# EasyEDA schematic 1-Schematic_Delta.json
TITLE: Sheet_1; REV: 1.0; Date: 2026-04-15; Sheet: 1/1; Drawn By: DosLike; Company: Your Company
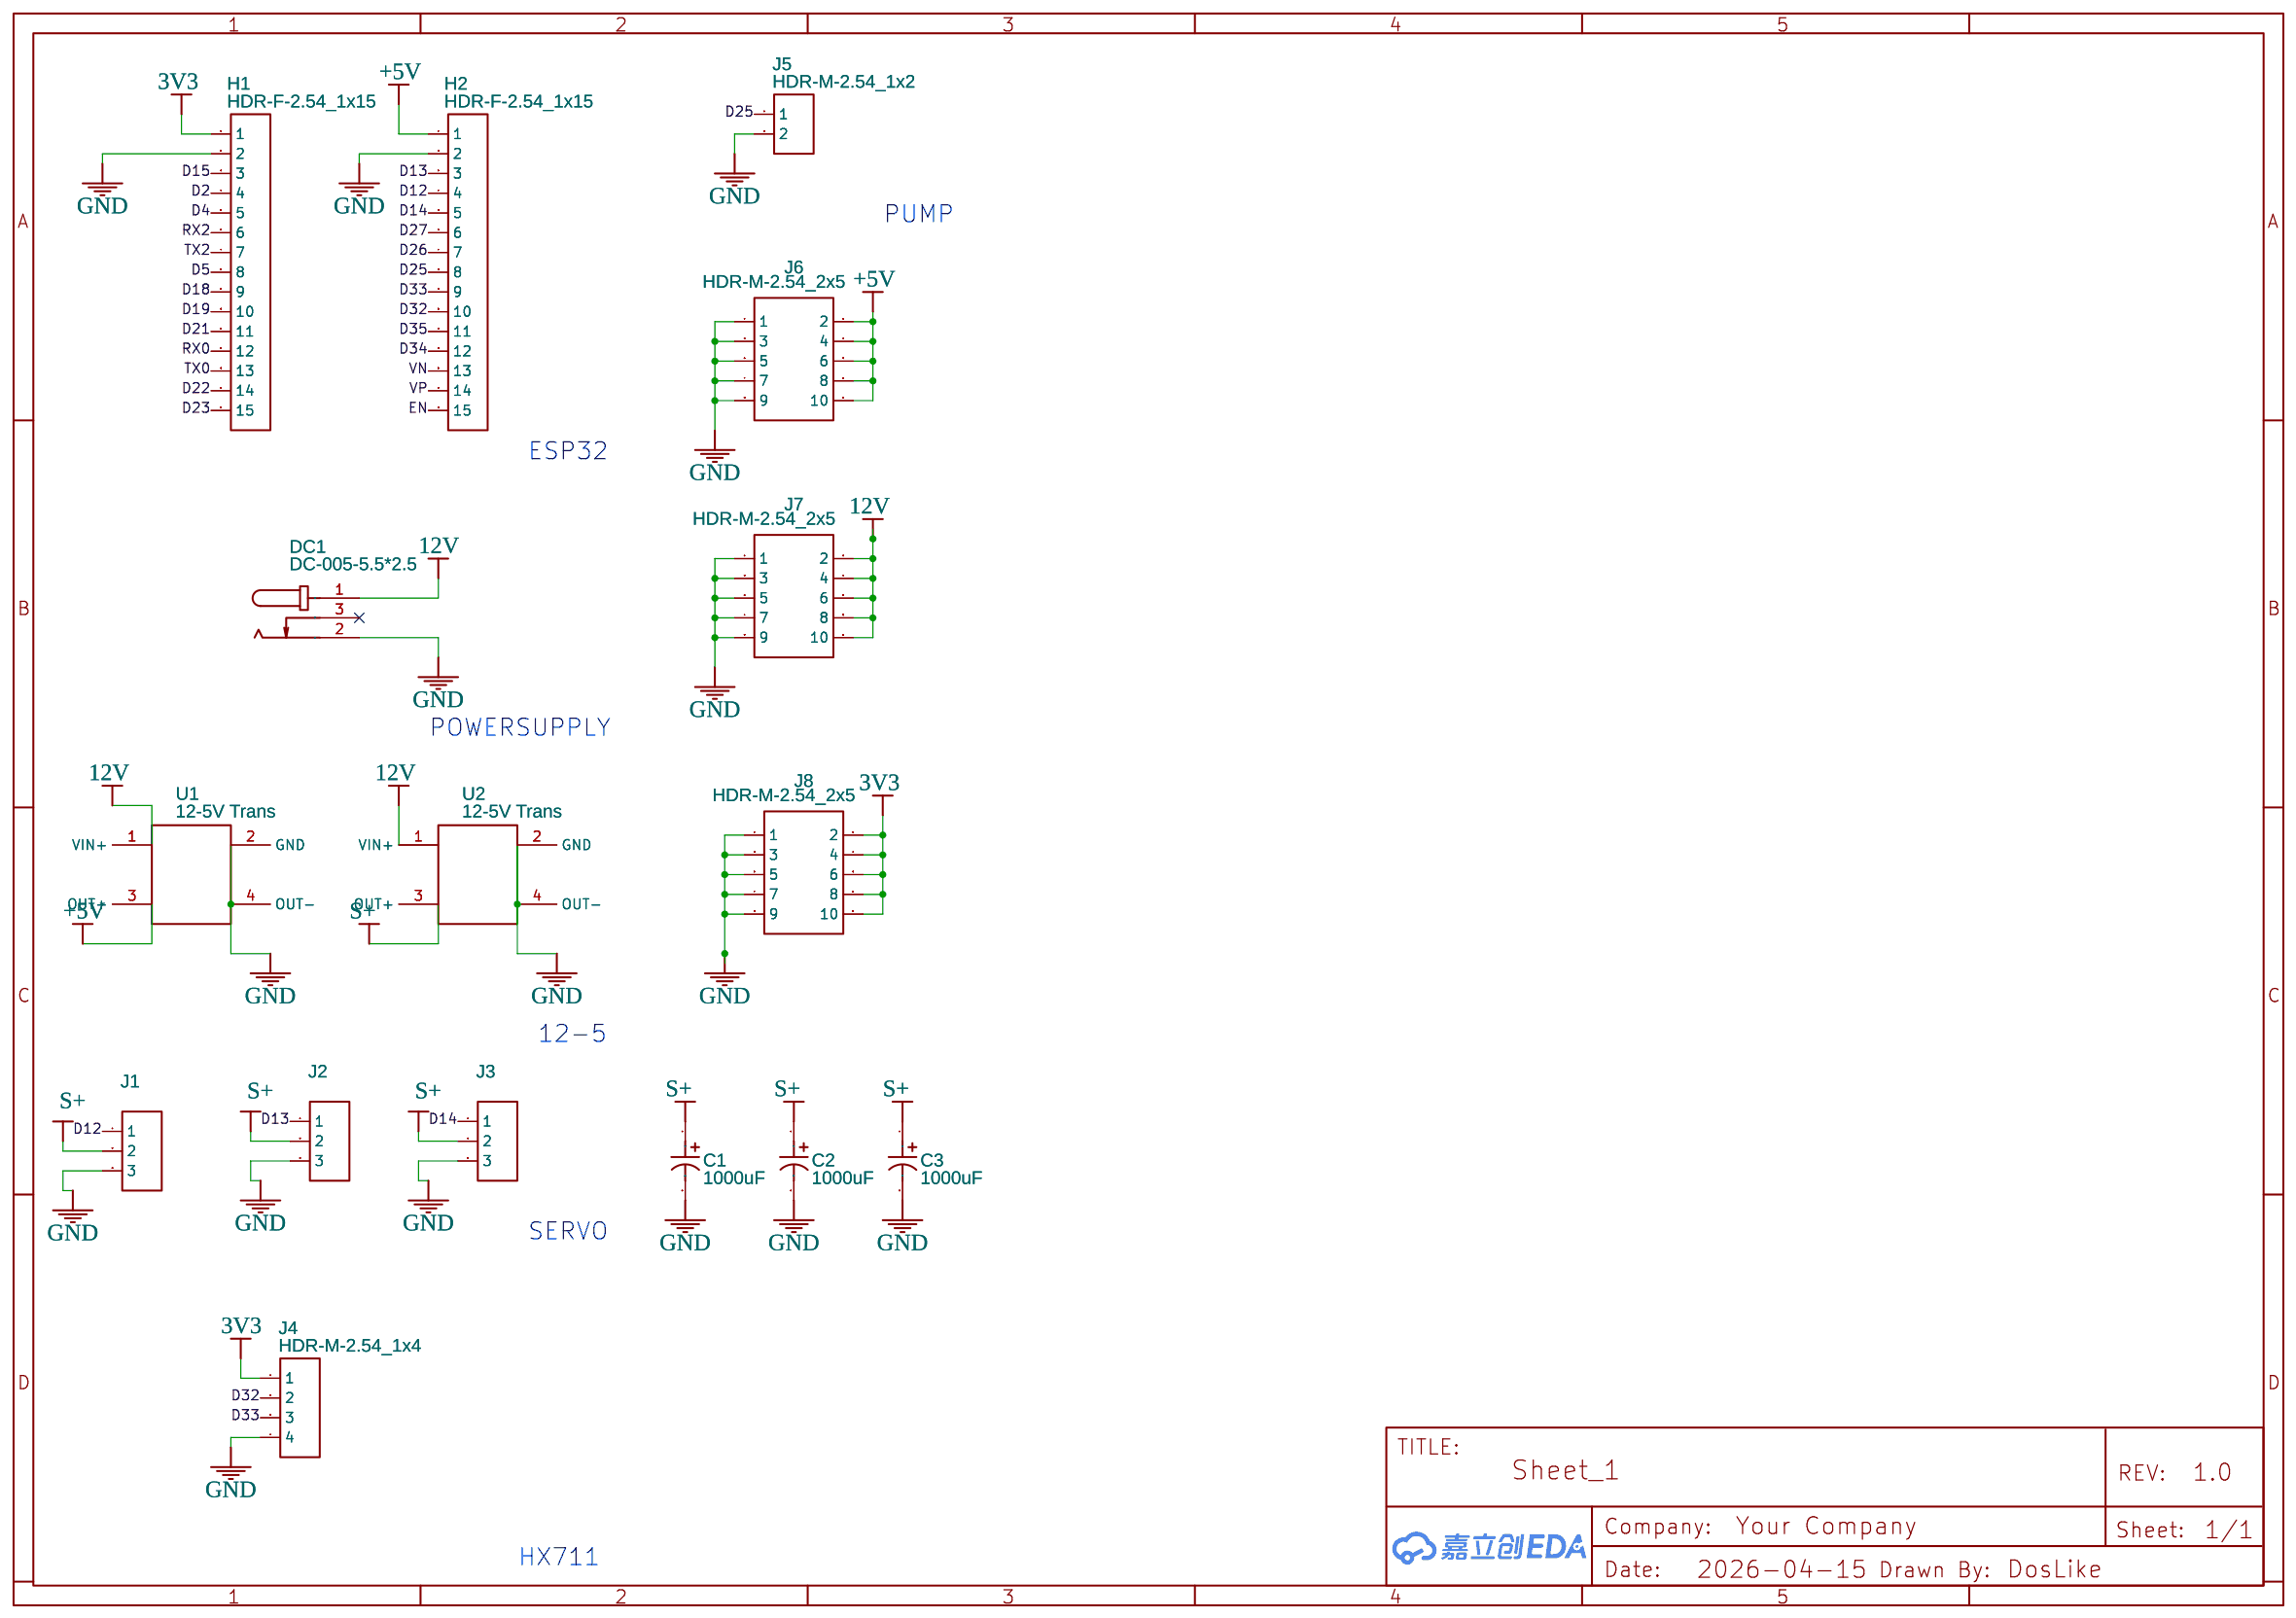
[diagram p0: schematic sheet]

## Parts
C1  1000uF  [CAP-TH_BD6.3-P2.50-D0.6-FD_RYHS16V1000UF6X15]
C2  1000uF  [CAP-TH_BD6.3-P2.50-D0.6-FD_RYHS16V1000UF6X15]
C3  1000uF  [CAP-TH_BD6.3-P2.50-D0.6-FD_RYHS16V1000UF6X15]
DC1  DC-005-5.5*2.5  [DC-IN-TH_DC-005-2]
H1  HDR-F-2.54_1x15  [HDR-F-2.54_1X15]
H2  HDR-F-2.54_1x15  [HDR-F-2.54_1X15]
J1  3  [HDR-M-2.54_1X3]
J2  HDR-M-2.54_1x3  [HDR-M-2.54_1X3]
J3  HDR-M-2.54_1x3  [HDR-M-2.54_1X3]
J4  HDR-M-2.54_1x4  [HDR-M-2.54_1X4]
J5  HDR-M-2.54_1x2  [HDR-M-2.54_1X2]
J6  HDR-M-2.54_2x5  [HDR-M-2.54_2X5]
J7  HDR-M-2.54_2x5  [HDR-M-2.54_2X5]
J8  HDR-M-2.54_2x5  [HDR-M-2.54_2X5]
U1  12-5V Trans  [12-5]
U2  12-5V Trans  [12-5]

## Library data of the parts
C1-C3 = RYHS16V1000UF6*15: Supplier: LCSC; Supplier Part: C48970202; Manufacturer: HONOR(荣誉); JLCPCB Part Class: Extended Part; Contributor: lcsc; link: https://so.szlcsc.com/global.html?k=C48970202&ref=editor
DC1 = DC-005-5.5*2.5: Contributor: lcsc; Supplier: LCSC; Supplier Part: C9900017043; Manufacturer: null; JLCPCB Part Class: Extended Part; link: https://so.szlcsc.com/global.html?k=C9900017043&ref=editor
H1 H2 = HDR-F-2.54_1x15: Supplier Part: C124408; Supplier: LCSC; Contributor: LCEDA_Lib
J1-J3 = HDR-M-2.54_1x3: Supplier Part: C180248; Supplier: LCSC; Contributor: LCEDA_Lib
J4 = HDR-M-2.54_1x4: Supplier Part: C124378; Supplier: LCSC; Contributor: LCEDA_Lib
J5 = HDR-M-2.54_1x2: Supplier Part: C124375; Supplier: LCSC; Contributor: LCEDA_Lib
J6-J8 = HDR-M-2.54_2x5: Supplier Part: C178292; Supplier: LCSC; Contributor: LCEDA_Lib
U1 U2 = 12-5V Trans: Contributor: doslike

## Nets
3V3: H1.1 J4.1 J8.2 J8.4 J8.6 J8.8 J8.10
12V: DC1.1 J7.2 J7.4 J7.6 J7.8 J7.10 U1.1(VIN+) U2.1(VIN+)
+5V: H2.1 J6.2 J6.4 J6.6 J6.8 J6.10 U1.3(OUT+)
GND: C1.2 C2.2 C3.2 DC1.2 H1.2 H2.2 J1.3 J2.3 J3.3 J4.4 J5.2 J6.1 J6.3 J6.5 J6.7 J6.9 J7.1 J7.3 J7.5 J7.7 J7.9 J8.1 J8.3 J8.5 J8.7 J8.9 U1.2(GND) U1.4(OUT-) U2.2(GND) U2.4(OUT-)
D2: H1.4
D4: H1.5
D5: H1.8
D12: H2.4 J1.1
D13: H2.3 J2.1
D14: H2.5 J3.1
D15: H1.3
D18: H1.9
D19: H1.10
D21: H1.11
D22: H1.14
D23: H1.15
D25: H2.8 J5.1
D26: H2.7
D27: H2.6
D32: H2.10 J4.2
D33: H2.9 J4.3
D34: H2.12
D35: H2.11
EN: H2.15
RX0: H1.12
RX2: H1.6
S+: C1.1 C2.1 C3.1 J1.2 J2.2 J3.2 U2.3(OUT+)
TX0: H1.13
TX2: H1.7
VN: H2.13
VP: H2.14

Not connected (* = marked no-connect by the designer): DC1 3*

## Notes on the sheet
- PUMP
- ESP32
- POWERSUPPLY
- 12-5
- SERVO
- HX711
